# EAGLE design input stage (EAGLE 6.4)
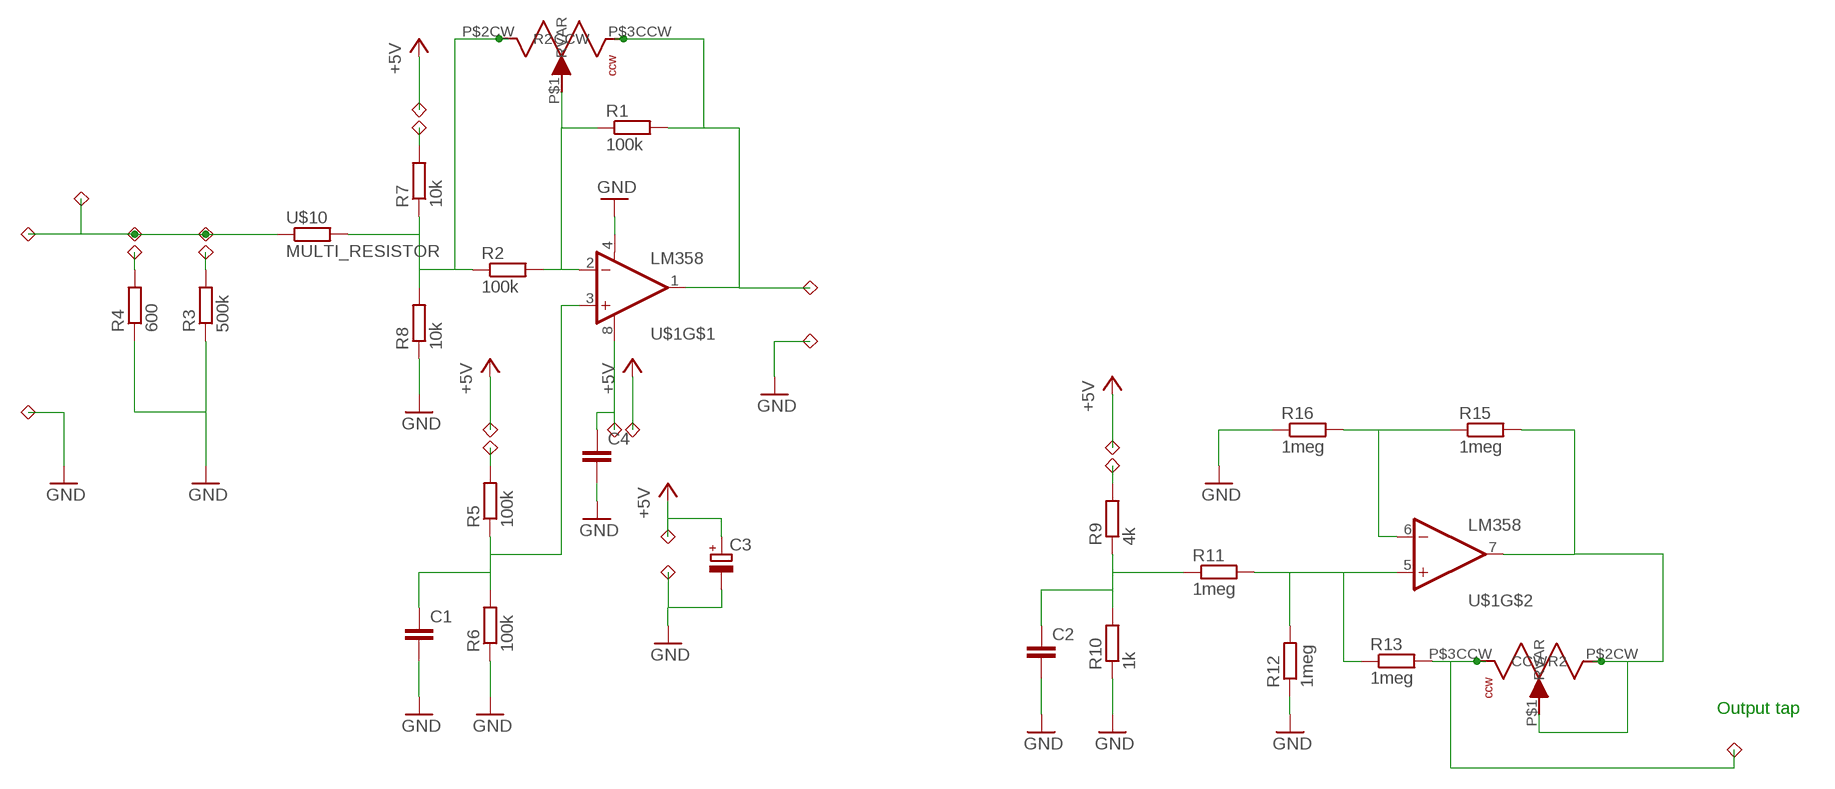
[diagram p0: schematic, sheet 1]

## Parts
C1  C-EUC0603  [C0603]
C2  C-EUC0603  [C0603]
C3  CPOL-EUC/6032-28R  [C/6032-28R]
C4  C-EUC0603  [C0603]
R1  100k  R-EU_R0603  [R0603]
R2  100k  R-EU_R0603  [R0603]
R3  500k  R-EU_R0603  [R0603]
R4  600  R-EU_R0603  [R0603]
R5  100k  R-EU_R0603  [R0603]
R6  100k  R-EU_R0603  [R0603]
R7  10k  R-EU_R0603  [R0603]
R8  10k  R-EU_R0603  [R0603]
R9  4k  R-EU_R0603  [R0603]
R10  1k  R-EU_R0603  [R0603]
R11  1meg  R-EU_R0603  [R0603]
R12  1meg  R-EU_R0603  [R0603]
R13  1meg  R-EU_R0603  [R0603]
R15  1meg  R-EU_R0603  [R0603]
R16  1meg  R-EU_R0603  [R0603]
U$1  LM358  [SO08]
U$2  1PIN  [THUMBNAIL]
U$3  1PIN  [THUMBNAIL]
U$4  1PIN  [THUMBNAIL]
U$5  1PIN  [THUMBNAIL]
U$6  1PIN  [THUMBNAIL]
U$7  1PIN  [THUMBNAIL]
U$8  1PIN  [THUMBNAIL]
U$9  1PIN  [THUMBNAIL]
U$10  MULTI_RESISTOR  [MULTI_PAD]
U$11  1PIN  [THUMBNAIL]
U$12  1PIN  [THUMBNAIL]
U$13  1PIN  [THUMBNAIL]
U$14  1PIN  [THUMBNAIL]
U$15  SMD-POT  [POT_PADS]
U$16  1PIN_SM  [THUMBNAIL_SM]
U$17  1PIN_SM  [THUMBNAIL_SM]
U$18  1PIN_SM  [THUMBNAIL_SM]
U$19  1PIN_SM  [THUMBNAIL_SM]
U$20  1PIN_SM  [THUMBNAIL_SM]
U$21  1PIN_SM  [THUMBNAIL_SM]
U$22  1PIN_SM  [THUMBNAIL_SM]
U$23  1PIN_SM  [THUMBNAIL_SM]
U$24  SMD-POT  [POT_PADS]

## Nets
+5V: C3.+ U$2.P$1 U$17.P$1 U$19.P$1 U$21.P$1 U$23.P$1
GND: C1.2 C2.2 C3.- C4.2 R3.1 R4.1 R6.1 R8.1 R10.1 R12.1 R16.1 U$1.4(V-) U$3.P$1 U$8.P$1 U$9.P$1
N$1: C1.1 R5.1 R6.2 U$1.3(+IN)
N$2: R1.1 R2.2 U$1.2(-IN) U$24.P$1(RVAR)
N$3: U$5.P$1 U$6.P$1 U$10.1 U$12.P$1 U$13.P$1
N$4: R1.2 U$1.1(OUT) U$4.P$1 U$24.P$3CCW(CCW)
N$5: R4.2 U$7.P$1
N$6: R2.1 R7.1 R8.2 U$10.2 U$24.P$2CW(R2)
N$7: R3.2 U$11.P$1
N$8: C2.1 R9.1 R10.2 R11.1
N$9: R15.1 R16.2 U$1.6(-IN)
N$10: R15.2 U$1.7(OUT) U$15.P$1(RVAR) U$15.P$2CW(R2)
N$11: R13.2 U$14.P$1 U$15.P$3CCW(CCW)
N$12: R11.2 R12.2 R13.1 U$1.5(+IN)
N$13: R9.2 U$16.P$1
N$14: R7.2 U$18.P$1
N$15: R5.2 U$20.P$1
N$17: C4.1 U$1.8(V+) U$22.P$1

## Notes on the sheet
- Output tap

## Library data of the parts
C1 C2 C4 = rcl:C-EU: CAPACITOR, European symbol
C3 = rcl:CPOL-EU: POLARIZED CAPACITOR, European symbol
R1-R13 R15 R16 = rcl:R-EU_: RESISTOR, European symbol
U$1 = synth_design:LM358
U$2-U$9 U$11-U$14 = multi-smt:1PIN
U$10 = multi-smt:MULTI_RESISTOR
U$15 U$24 = synth_design:SMD-POT
U$16-U$23 = multi-smt:1PIN_SM

## Board
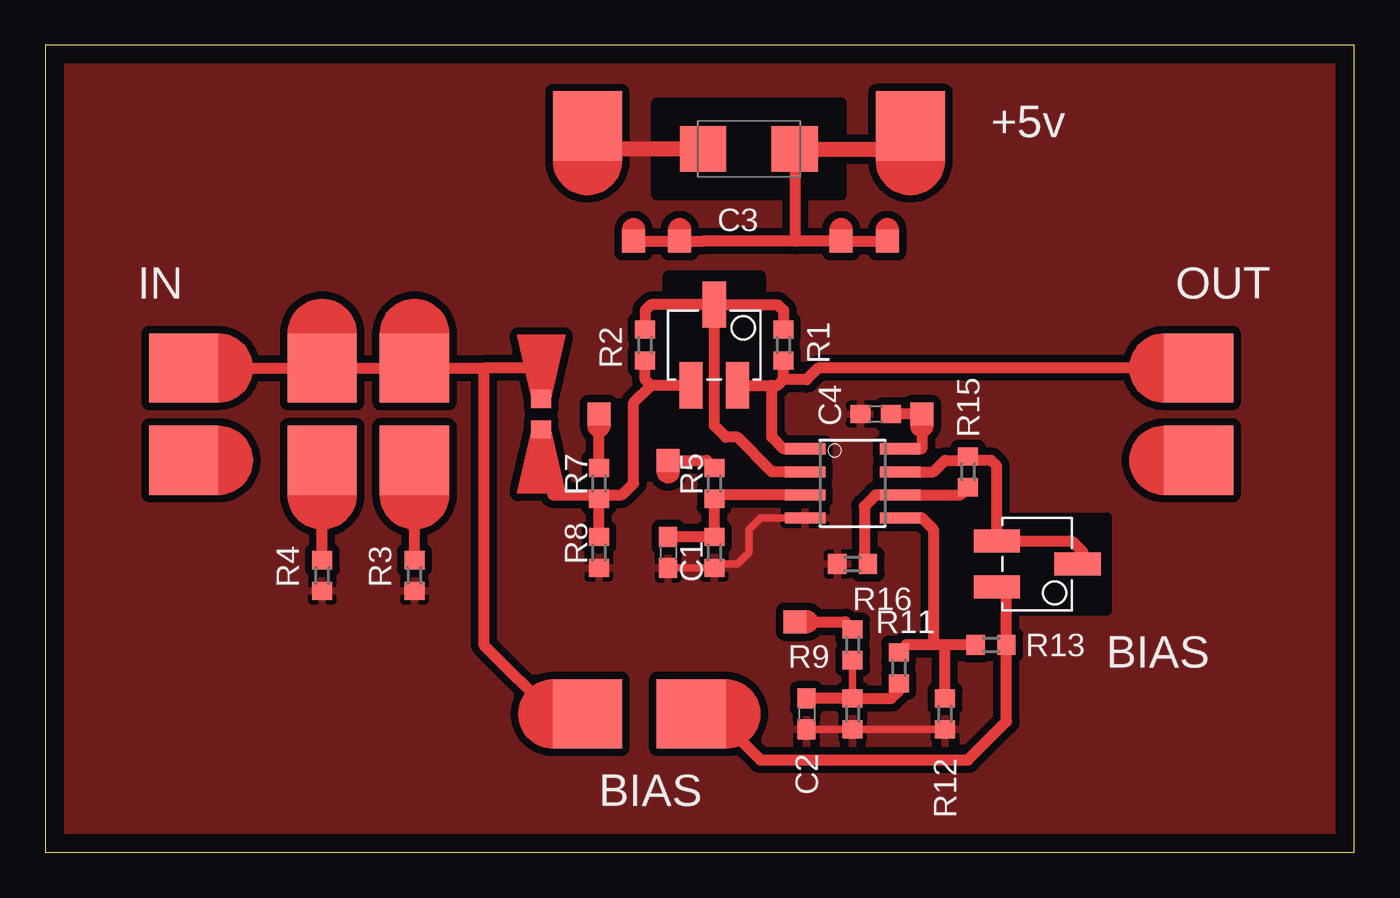
[diagram p1: board, top side]

Size 72.06 x 44.44 mm. Coordinates in mm from the lower left corner, seen from the top.
Outline: 0,0 72.06,0 72.06,44.44 0,44.44 0,0
Copper layers (1*16): Top 0.035mm / dielectric 1.5mm / Bottom 0.035mm
Design rules "default *": minimum track width 10mil, minimum drill 24mil, track to track 16mil, track to pad 16mil, pad to pad 16mil, via to via 16mil, smd to smd 16mil, copper to edge 40mil, drill to drill 8mil, minimum pad ring 10mil, minimum via ring 8mil, stop-mask expansion 4mil, vias tented up to drill 0mil, thermal gap 10mil
tRestrict: area 50.8,13.3 to 58.4,18.4; area 33.7,36.2 to 43.8,41.3; area 34.3,24.1 to 39.4,31.8

### Footprints (pad centres in the part's own frame; a part is rotated, then mirrored left to right if it is on the bottom)
C0603 = smd 1.1 x 1: 1 -0.85,0; 2 0.85,0
C/6032-28R = smd 2.55 x 2.5: + 2.525,0; - -2.525,0
R0603 = smd 1 x 1.1: 1 -0.85,0; 2 0.85,0
SO08 = smd 0.61 x 2.21: 1 -1.905,-2.616; 2 -0.635,-2.616; 3 0.635,-2.616; 4 1.905,-2.616; 5 1.905,2.616; 6 0.635,2.616; 7 -0.635,2.616; 8 -1.905,2.616
THUMBNAIL = smd 3.81 x 3.81: P$1 0,0
MULTI_PAD = smd 1 x 1.1: 1 -0.85,0; 2 0.85,0
POT_PADS = smd 2.54 x 1.27: P$1 2.223,0; P$2CW -2.223,1.27; P$3CCW -2.223,-1.27
THUMBNAIL_SM = smd 1.27 x 1.27: P$1 0,0

### Placement (x,y rotation side)
C1  34.29,16.51 270 top
C2  41.91,7.62 270 top
C3  38.73,38.73 0 top
C4  45.72,24.13 180 top
R1  40.64,27.94 270 top
R2  33.02,27.94 90 top
R3  20.32,15.24 90 top
R4  15.24,15.24 90 top
R5  36.83,20.32 90 top
R6  36.83,16.51 90 top
R7  30.48,20.32 90 top
R8  30.48,16.51 90 top
R9  44.45,11.43 90 top
R10  44.45,7.62 90 top
R11  46.99,10.16 90 top
R12  49.53,7.62 90 top
R13  52.07,11.43 0 top
R15  50.8,20.95 90 top
R16  44.45,15.88 0 top
U$1  44.45,20.32 270 top
U$2  47.62,40.01 270 top
U$3  29.84,40.01 270 top
U$4  63.5,26.67 180 top
U$5  15.24,26.67 90 top
U$6  7.62,26.67 0 top
U$7  15.24,21.59 270 top
U$8  7.62,21.59 0 top
U$9  63.5,21.59 180 top
U$10  27.3,24.13 270 top
U$11  20.32,21.59 270 top
U$12  20.32,26.67 90 top
U$13  29.84,7.62 180 top
U$14  35.56,7.62 0 top
U$15  54.61,15.88 0 top
U$16  41.27,12.7 0 top
U$17  32.38,33.66 90 top
U$18  30.48,24.13 270 top
U$19  34.92,33.66 90 top
U$20  34.29,21.59 270 top
U$21  43.81,33.66 90 top
U$22  48.26,24.13 270 top
U$23  46.35,33.66 90 top
U$24  36.83,27.94 90 top

### Tracks (layer width: path | path; a pad name or v marks a point on that pad's centre or on a via)
+5V
  Top 0.406: 36.18,33.67 36.2,33.66
  Top 0.61: U$17.P$1 U$19.P$1 36.2,33.66 41.27,33.66 | U$23.P$1 U$21.P$1 41.27,33.66 | U$2.P$1 47.62,38.73 41.27,38.73 41.27,33.66
  Top 0.813: C3.+ 47.62,38.73
GND
  Top 0.406: C2.2 R10.1 R12.1 | U$1.4 39.37,18.41 38.73,17.78 38.73,16.51 38.1,15.88 37.05,15.88 R6.1 C1.2
  Top 0.813: C3.- 31.11,38.73 U$3.P$1
  pour Top: 0,44.45 72.39,44.45 72.39,0 0,0
N$1
  Top 0.406: 37.05,19.68 R5.1
  Top 0.61: U$1.3 37.05,19.68 | R5.1 R6.2 C1.1
N$2
  Top 0.61: U$24.P$1 33.34,30.16 33.02,29.84 R2.2 | U$24.P$1 40.32,30.16 40.64,29.84 R1.1 | U$1.2 40.01,20.95 38.1,22.86 37.47,22.86 36.83,23.5 U$24.P$1
N$3
  Top 0.406: 27.94,7.62 U$13.P$1 | U$10.1 26.67,26.67
  Top 0.61: 24.13,26.67 U$12.P$1 U$5.P$1 U$6.P$1 | 24.13,26.67 24.13,11.43 27.94,7.62 | 26.67,26.67 24.13,26.67
N$4
  Top 0.61: U$24.P$3CCW 40.01,25.72 | 40.01,25.72 40.32,25.72 40.64,26.04 | 40.64,26.04 R1.2 | U$1.1 40.64,22.23 40.01,22.86 40.01,25.72 | U$4.P$1 42.55,26.67 41.91,26.04 40.64,26.04
N$5
  Top 0.61: R4.2 U$7.P$1
N$6
  Top 0.406: 30.27,19.68 R7.1
  Top 0.61: U$10.2 27.94,19.68 30.27,19.68 31.75,19.68 32.38,20.32 32.38,24.77 33.34,25.72 | R8.2 R7.1 | U$24.P$2CW 33.34,25.72 | 33.34,25.72 33.02,26.04 R2.1
N$7
  Top 0.61: R3.2 U$11.P$1
N$8
  Top 0.406: 46.99,8.89 R11.1 | R10.2 R9.1
  Top 0.61: 46.99,8.89 46.57,8.47 R10.2 C2.1
N$9
  Top 0.406: 45.09,16.09 R16.2
  Top 0.61: 45.09,16.09 45.09,19.05 45.72,19.68 U$1.6 50.38,19.68 R15.1
N$10
  Top 0.61: U$15.P$1 57.15,16.19 57.15,16.51 56.52,17.14 U$15.P$2CW 52.39,21.27 52.07,21.59 51.02,21.59 R15.2 50.59,21.59 49.53,21.59 48.9,20.95 U$1.7
N$11
  Top 0.406: U$14.P$1 36.83,6.35 38.1,6.35
  Top 0.61: 38.1,6.35 39.37,5.08 50.8,5.08 52.92,7.2 R13.2 52.92,14.07 U$15.P$3CCW
N$12
  Top 0.61: R13.1 49.53,11.43 | 49.53,11.43 48.9,11.43 | 48.9,11.43 47.41,11.43 R11.2 | U$1.5 48.26,18.41 48.9,17.78 48.9,11.43 | R12.2 49.53,11.43
N$13
  Top 0.61: U$16.P$1 44.03,12.7 R9.2
N$14
  Top 0.61: R7.2 U$18.P$1
N$15
  Top 0.61: U$20.P$1 36.41,21.59 R5.2
N$17
  Top 0.61: U$1.8 48.26,22.23 U$22.P$1 C4.1

### Text on the board
tNames: +5v | IN | OUT | BIAS | BIAS